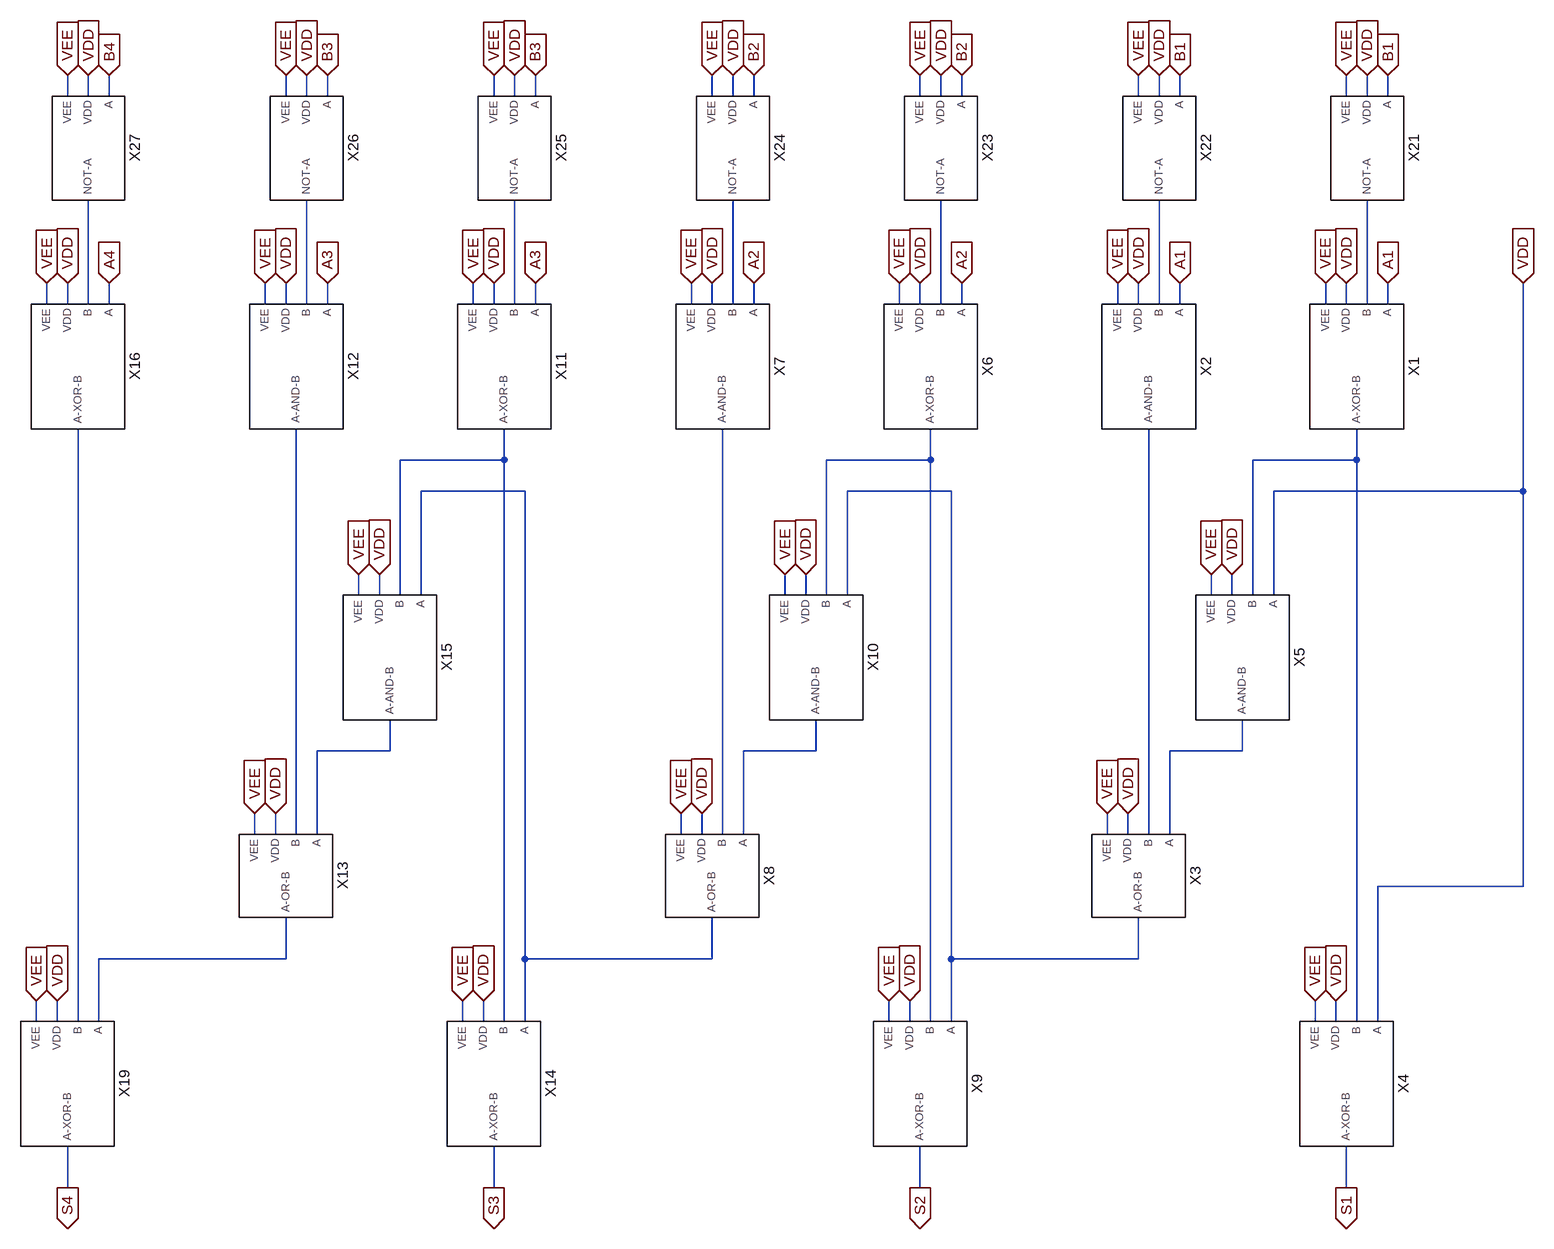
[diagram p0: schematic 4_Bit_Subtractor_Symbol.asc]
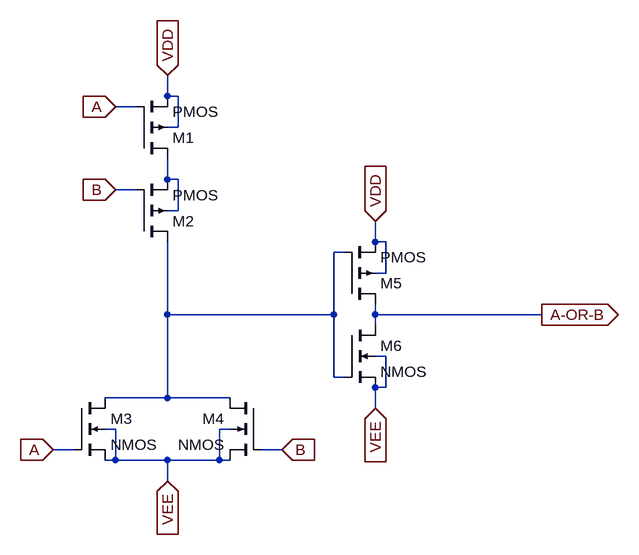
[diagram p1: sub-circuit 2_input_or_gate_symbol.asc]
4_Bit_Subtractor_Symbol.asc, the LTspice schematic file:
Version 4
SHEET 1 2440 1132
WIRE -416 -656 -416 -688
WIRE -384 -656 -384 -688
WIRE -352 -656 -352 -688
WIRE -80 -656 -80 -688
WIRE -48 -656 -48 -688
WIRE -16 -656 -16 -688
WIRE 240 -656 240 -688
WIRE 272 -656 272 -688
WIRE 304 -656 304 -688
WIRE 576 -656 576 -688
WIRE 608 -656 608 -688
WIRE 640 -656 640 -688
WIRE 896 -656 896 -688
WIRE 928 -656 928 -688
WIRE 960 -656 960 -688
WIRE 1232 -656 1232 -688
WIRE 1264 -656 1264 -688
WIRE 1296 -656 1296 -688
WIRE 1552 -656 1552 -688
WIRE 1584 -656 1584 -688
WIRE 1616 -656 1616 -688
WIRE -448 -336 -448 -368
WIRE -416 -336 -416 -368
WIRE -384 -336 -384 -496
WIRE -352 -336 -352 -368
WIRE -112 -336 -112 -368
WIRE -80 -336 -80 -368
WIRE -48 -336 -48 -496
WIRE -16 -336 -16 -368
WIRE 208 -336 208 -368
WIRE 240 -336 240 -368
WIRE 272 -336 272 -496
WIRE 304 -336 304 -368
WIRE 544 -336 544 -368
WIRE 576 -336 576 -368
WIRE 608 -336 608 -496
WIRE 640 -336 640 -368
WIRE 864 -336 864 -368
WIRE 896 -336 896 -368
WIRE 928 -336 928 -496
WIRE 960 -336 960 -368
WIRE 1200 -336 1200 -368
WIRE 1232 -336 1232 -368
WIRE 1264 -336 1264 -496
WIRE 1296 -336 1296 -368
WIRE 1520 -336 1520 -368
WIRE 1552 -336 1552 -368
WIRE 1584 -336 1584 -496
WIRE 1616 -336 1616 -368
WIRE 256 -96 256 -144
WIRE 256 -96 96 -96
WIRE 912 -96 912 -144
WIRE 912 -96 752 -96
WIRE 1568 -96 1568 -144
WIRE 1568 -96 1408 -96
WIRE 288 -48 128 -48
WIRE 944 -48 784 -48
WIRE 1824 -48 1824 -368
WIRE 1824 -48 1440 -48
WIRE 32 112 32 80
WIRE 64 112 64 80
WIRE 96 112 96 -96
WIRE 128 112 128 -48
WIRE 688 112 688 80
WIRE 720 112 720 80
WIRE 752 112 752 -96
WIRE 784 112 784 -48
WIRE 1344 112 1344 80
WIRE 1376 112 1376 80
WIRE 1408 112 1408 -96
WIRE 1440 112 1440 -48
WIRE 80 352 80 304
WIRE 80 352 -32 352
WIRE 736 352 736 304
WIRE 736 352 624 352
WIRE 1392 352 1392 304
WIRE 1392 352 1280 352
WIRE -128 480 -128 448
WIRE -96 480 -96 448
WIRE -64 480 -64 -144
WIRE -32 480 -32 352
WIRE 528 480 528 448
WIRE 560 480 560 448
WIRE 592 480 592 -144
WIRE 624 480 624 352
WIRE 1184 480 1184 448
WIRE 1216 480 1216 448
WIRE 1248 480 1248 -144
WIRE 1280 480 1280 352
WIRE 1824 560 1824 -48
WIRE 1824 560 1600 560
WIRE -80 672 -80 608
WIRE -80 672 -368 672
WIRE 288 672 288 -48
WIRE 576 672 576 608
WIRE 576 672 288 672
WIRE 944 672 944 -48
WIRE 1232 672 1232 608
WIRE 1232 672 944 672
WIRE -464 768 -464 736
WIRE -432 768 -432 736
WIRE -400 768 -400 -144
WIRE -368 768 -368 672
WIRE 192 768 192 736
WIRE 224 768 224 736
WIRE 256 768 256 -96
WIRE 288 768 288 672
WIRE 848 768 848 736
WIRE 880 768 880 736
WIRE 912 768 912 -96
WIRE 944 768 944 672
WIRE 1504 768 1504 736
WIRE 1536 768 1536 736
WIRE 1568 768 1568 -96
WIRE 1600 768 1600 560
WIRE -416 1024 -416 960
WIRE 240 1024 240 960
WIRE 896 1024 896 960
WIRE 1552 1024 1552 960
FLAG -416 -368 VDD
IOPIN -416 -368 In
FLAG -80 -368 VDD
IOPIN -80 -368 In
FLAG 240 -368 VDD
IOPIN 240 -368 In
FLAG 576 -368 VDD
IOPIN 576 -368 In
FLAG 896 -368 VDD
IOPIN 896 -368 In
FLAG 1232 -368 VDD
IOPIN 1232 -368 In
FLAG 1552 -368 VDD
IOPIN 1552 -368 In
FLAG 1376 80 VDD
IOPIN 1376 80 In
FLAG 1216 448 VDD
IOPIN 1216 448 In
FLAG 1536 736 VDD
IOPIN 1536 736 In
FLAG 880 736 VDD
IOPIN 880 736 In
FLAG 720 80 VDD
IOPIN 720 80 In
FLAG 64 80 VDD
IOPIN 64 80 In
FLAG -96 448 VDD
IOPIN -96 448 In
FLAG 224 736 VDD
IOPIN 224 736 In
FLAG 560 448 VDD
IOPIN 560 448 In
FLAG -432 736 VDD
IOPIN -432 736 In
FLAG 1520 -368 VEE
IOPIN 1520 -368 In
FLAG 1200 -368 VEE
IOPIN 1200 -368 In
FLAG 864 -368 VEE
IOPIN 864 -368 In
FLAG 544 -368 VEE
IOPIN 544 -368 In
FLAG 208 -368 VEE
IOPIN 208 -368 In
FLAG -112 -368 VEE
IOPIN -112 -368 In
FLAG -448 -368 VEE
IOPIN -448 -368 In
FLAG 32 80 VEE
IOPIN 32 80 In
FLAG 688 80 VEE
IOPIN 688 80 In
FLAG 1344 80 VEE
IOPIN 1344 80 In
FLAG 1184 448 VEE
IOPIN 1184 448 In
FLAG 528 448 VEE
IOPIN 528 448 In
FLAG -128 448 VEE
IOPIN -128 448 In
FLAG -464 736 VEE
IOPIN -464 736 In
FLAG 192 736 VEE
IOPIN 192 736 In
FLAG 848 736 VEE
IOPIN 848 736 In
FLAG 1504 736 VEE
IOPIN 1504 736 In
FLAG 1552 1024 S1
IOPIN 1552 1024 Out
FLAG 896 1024 S2
IOPIN 896 1024 Out
FLAG 240 1024 S3
IOPIN 240 1024 Out
FLAG -416 1024 S4
IOPIN -416 1024 Out
FLAG 1616 -368 A1
IOPIN 1616 -368 In
FLAG 1296 -368 A1
IOPIN 1296 -368 In
FLAG 960 -368 A2
IOPIN 960 -368 In
FLAG 640 -368 A2
IOPIN 640 -368 In
FLAG 304 -368 A3
IOPIN 304 -368 In
FLAG -16 -368 A3
IOPIN -16 -368 In
FLAG -352 -368 A4
IOPIN -352 -368 In
FLAG 1616 -688 B1
IOPIN 1616 -688 In
FLAG 1296 -688 B1
IOPIN 1296 -688 In
FLAG 960 -688 B2
IOPIN 960 -688 In
FLAG 640 -688 B2
IOPIN 640 -688 In
FLAG 304 -688 B3
IOPIN 304 -688 In
FLAG -16 -688 B3
IOPIN -16 -688 In
FLAG -352 -688 B4
IOPIN -352 -688 In
FLAG 1824 -368 VDD
IOPIN 1824 -368 In
FLAG -384 -688 VDD
IOPIN -384 -688 In
FLAG -416 -688 VEE
IOPIN -416 -688 In
FLAG -48 -688 VDD
IOPIN -48 -688 In
FLAG -80 -688 VEE
IOPIN -80 -688 In
FLAG 272 -688 VDD
IOPIN 272 -688 In
FLAG 240 -688 VEE
IOPIN 240 -688 In
FLAG 608 -688 VDD
IOPIN 608 -688 In
FLAG 576 -688 VEE
IOPIN 576 -688 In
FLAG 928 -688 VDD
IOPIN 928 -688 In
FLAG 896 -688 VEE
IOPIN 896 -688 In
FLAG 1264 -688 VDD
IOPIN 1264 -688 In
FLAG 1232 -688 VEE
IOPIN 1232 -688 In
FLAG 1584 -688 VDD
IOPIN 1584 -688 In
FLAG 1552 -688 VEE
IOPIN 1552 -688 In
SYMBOL 2_Input_XOR_Gate_Symbol 1568 -240 R90
SYMATTR InstName X1
SYMBOL 2_Input_AND_Gate_Symbol 1248 -240 R90
SYMATTR InstName X2
SYMBOL 2_Input_OR_Gate_Symbol 1232 544 R90
SYMATTR InstName X3
SYMBOL 2_Input_XOR_Gate_Symbol 1552 864 R90
SYMATTR InstName X4
SYMBOL 2_Input_AND_Gate_Symbol 1392 208 R90
SYMATTR InstName X5
SYMBOL 2_Input_XOR_Gate_Symbol 912 -240 R90
SYMATTR InstName X6
SYMBOL 2_Input_AND_Gate_Symbol 592 -240 R90
SYMATTR InstName X7
SYMBOL 2_Input_OR_Gate_Symbol 576 544 R90
SYMATTR InstName X8
SYMBOL 2_Input_XOR_Gate_Symbol 896 864 R90
SYMATTR InstName X9
SYMBOL 2_Input_AND_Gate_Symbol 736 208 R90
SYMATTR InstName X10
SYMBOL 2_Input_XOR_Gate_Symbol 256 -240 R90
SYMATTR InstName X11
SYMBOL 2_Input_AND_Gate_Symbol -64 -240 R90
SYMATTR InstName X12
SYMBOL 2_Input_OR_Gate_Symbol -80 544 R90
SYMATTR InstName X13
SYMBOL 2_Input_XOR_Gate_Symbol 240 864 R90
SYMATTR InstName X14
SYMBOL 2_Input_AND_Gate_Symbol 80 208 R90
SYMATTR InstName X15
SYMBOL 2_Input_XOR_Gate_Symbol -400 -240 R90
SYMATTR InstName X16
SYMBOL 2_Input_XOR_Gate_Symbol -416 864 R90
SYMATTR InstName X19
SYMBOL Inverter_Gate_Symbol 1584 -576 R90
SYMATTR InstName X21
SYMBOL Inverter_Gate_Symbol 1264 -576 R90
SYMATTR InstName X22
SYMBOL Inverter_Gate_Symbol 928 -576 R90
SYMATTR InstName X23
SYMBOL Inverter_Gate_Symbol 608 -576 R90
SYMATTR InstName X24
SYMBOL Inverter_Gate_Symbol 272 -576 R90
SYMATTR InstName X25
SYMBOL Inverter_Gate_Symbol -48 -576 R90
SYMATTR InstName X26
SYMBOL Inverter_Gate_Symbol -384 -576 R90
SYMATTR InstName X27

2_input_or_gate_symbol.asc, the sub-circuit schematic file:
Version 4
SHEET 1 1612 1096
WIRE 912 416 912 384
WIRE 928 416 912 416
WIRE 864 432 832 432
WIRE 928 464 928 416
WIRE 928 464 912 464
WIRE 912 544 912 512
WIRE 928 544 912 544
WIRE 864 560 832 560
WIRE 928 592 928 544
WIRE 928 592 912 592
WIRE 1232 640 1232 608
WIRE 1248 640 1232 640
WIRE 1184 656 1168 656
WIRE 1248 688 1248 640
WIRE 1248 688 1232 688
WIRE 912 752 912 640
WIRE 1168 752 1168 656
WIRE 1168 752 912 752
WIRE 1232 752 1232 736
WIRE 1488 752 1232 752
WIRE 1232 768 1232 752
WIRE 1248 816 1232 816
WIRE 1168 848 1168 752
WIRE 1184 848 1168 848
WIRE 1248 864 1248 816
WIRE 1248 864 1232 864
WIRE 912 880 912 752
WIRE 912 880 816 880
WIRE 1008 880 912 880
WIRE 1232 896 1232 864
WIRE 832 928 816 928
WIRE 1008 928 992 928
WIRE 768 960 736 960
WIRE 1088 960 1056 960
WIRE 832 976 832 928
WIRE 832 976 816 976
WIRE 912 976 832 976
WIRE 992 976 992 928
WIRE 992 976 912 976
WIRE 1008 976 992 976
WIRE 912 1008 912 976
FLAG 912 384 VDD
IOPIN 912 384 In
FLAG 912 1008 VEE
IOPIN 912 1008 In
FLAG 1232 896 VEE
IOPIN 1232 896 In
FLAG 1232 608 VDD
IOPIN 1232 608 In
FLAG 1488 752 A-OR-B
IOPIN 1488 752 Out
FLAG 832 432 A
IOPIN 832 432 In
FLAG 736 960 A
IOPIN 736 960 In
FLAG 1088 960 B
IOPIN 1088 960 In
FLAG 832 560 B
IOPIN 832 560 In
SYMBOL pmos4 864 512 M180
SYMATTR InstName M1
SYMBOL pmos4 864 640 M180
SYMATTR InstName M2
SYMBOL nmos4 768 880 R0
SYMATTR InstName M3
SYMBOL nmos4 1056 880 M0
SYMATTR InstName M4
SYMBOL pmos4 1184 736 M180
SYMATTR InstName M5
SYMBOL nmos4 1184 768 R0
SYMATTR InstName M6

The netlist it stands for:
* 4_Bit_Subtractor_Symbol.asc
XX1 A1 N007 VDD VEE N010 2_Input_XOR_Gate_Symbol  ; pins A B VDD VEE A-XOR-B
XX2 A1 N006 VDD VEE N018 2_Input_AND_Gate_Symbol  ; pins A B VDD VEE A-AND-B
XX3 N015 N018 VDD VEE N012 2_input_or_gate_symbol
XX4 VDD N010 VDD VEE S1 2_Input_XOR_Gate_Symbol  ; pins A B VDD VEE A-XOR-B
XX5 VDD N010 VDD VEE N015 2_Input_AND_Gate_Symbol  ; pins A B VDD VEE A-AND-B
XX6 A2 N005 VDD VEE N009 2_Input_XOR_Gate_Symbol  ; pins A B VDD VEE A-XOR-B
XX7 A2 N004 VDD VEE N017 2_Input_AND_Gate_Symbol  ; pins A B VDD VEE A-AND-B
XX8 N014 N017 VDD VEE N011 2_input_or_gate_symbol
XX9 N012 N009 VDD VEE S2 2_Input_XOR_Gate_Symbol  ; pins A B VDD VEE A-XOR-B
XX10 N012 N009 VDD VEE N014 2_Input_AND_Gate_Symbol  ; pins A B VDD VEE A-AND-B
XX11 A3 N003 VDD VEE N008 2_Input_XOR_Gate_Symbol  ; pins A B VDD VEE A-XOR-B
XX12 A3 N002 VDD VEE N016 2_Input_AND_Gate_Symbol  ; pins A B VDD VEE A-AND-B
XX13 N013 N016 VDD VEE N019 2_input_or_gate_symbol
XX14 N011 N008 VDD VEE S3 2_Input_XOR_Gate_Symbol  ; pins A B VDD VEE A-XOR-B
XX15 N011 N008 VDD VEE N013 2_Input_AND_Gate_Symbol  ; pins A B VDD VEE A-AND-B
XX16 A4 N001 VDD VEE N020 2_Input_XOR_Gate_Symbol  ; pins A B VDD VEE A-XOR-B
XX19 N019 N020 VDD VEE S4 2_Input_XOR_Gate_Symbol  ; pins A B VDD VEE A-XOR-B
XX21 B1 VDD VEE N007 Inverter_Gate_Symbol  ; pins A VDD VEE NOT-A
XX22 B1 VDD VEE N006 Inverter_Gate_Symbol  ; pins A VDD VEE NOT-A
XX23 B2 VDD VEE N005 Inverter_Gate_Symbol  ; pins A VDD VEE NOT-A
XX24 B2 VDD VEE N004 Inverter_Gate_Symbol  ; pins A VDD VEE NOT-A
XX25 B3 VDD VEE N003 Inverter_Gate_Symbol  ; pins A VDD VEE NOT-A
XX26 B3 VDD VEE N002 Inverter_Gate_Symbol  ; pins A VDD VEE NOT-A
XX27 B4 VDD VEE N001 Inverter_Gate_Symbol  ; pins A VDD VEE NOT-A

* block symbol definitions
.subckt 2_input_or_gate_symbol A B VDD VEE A-OR-B
M1 N001 A VDD VDD PMOS
M2 N002 B N001 N001 PMOS
M3 N002 A VEE VEE NMOS
M4 N002 B VEE VEE NMOS
M5 A-OR-B N002 VDD VDD PMOS
M6 A-OR-B N002 VEE VEE NMOS
.ends 2_input_or_gate_symbol

.model NMOS NMOS
.model PMOS PMOS
.lib standard.mos
.backanno
.end